# Altium schematic sheet Agilent_3Ghz_option.SchDoc
size A3
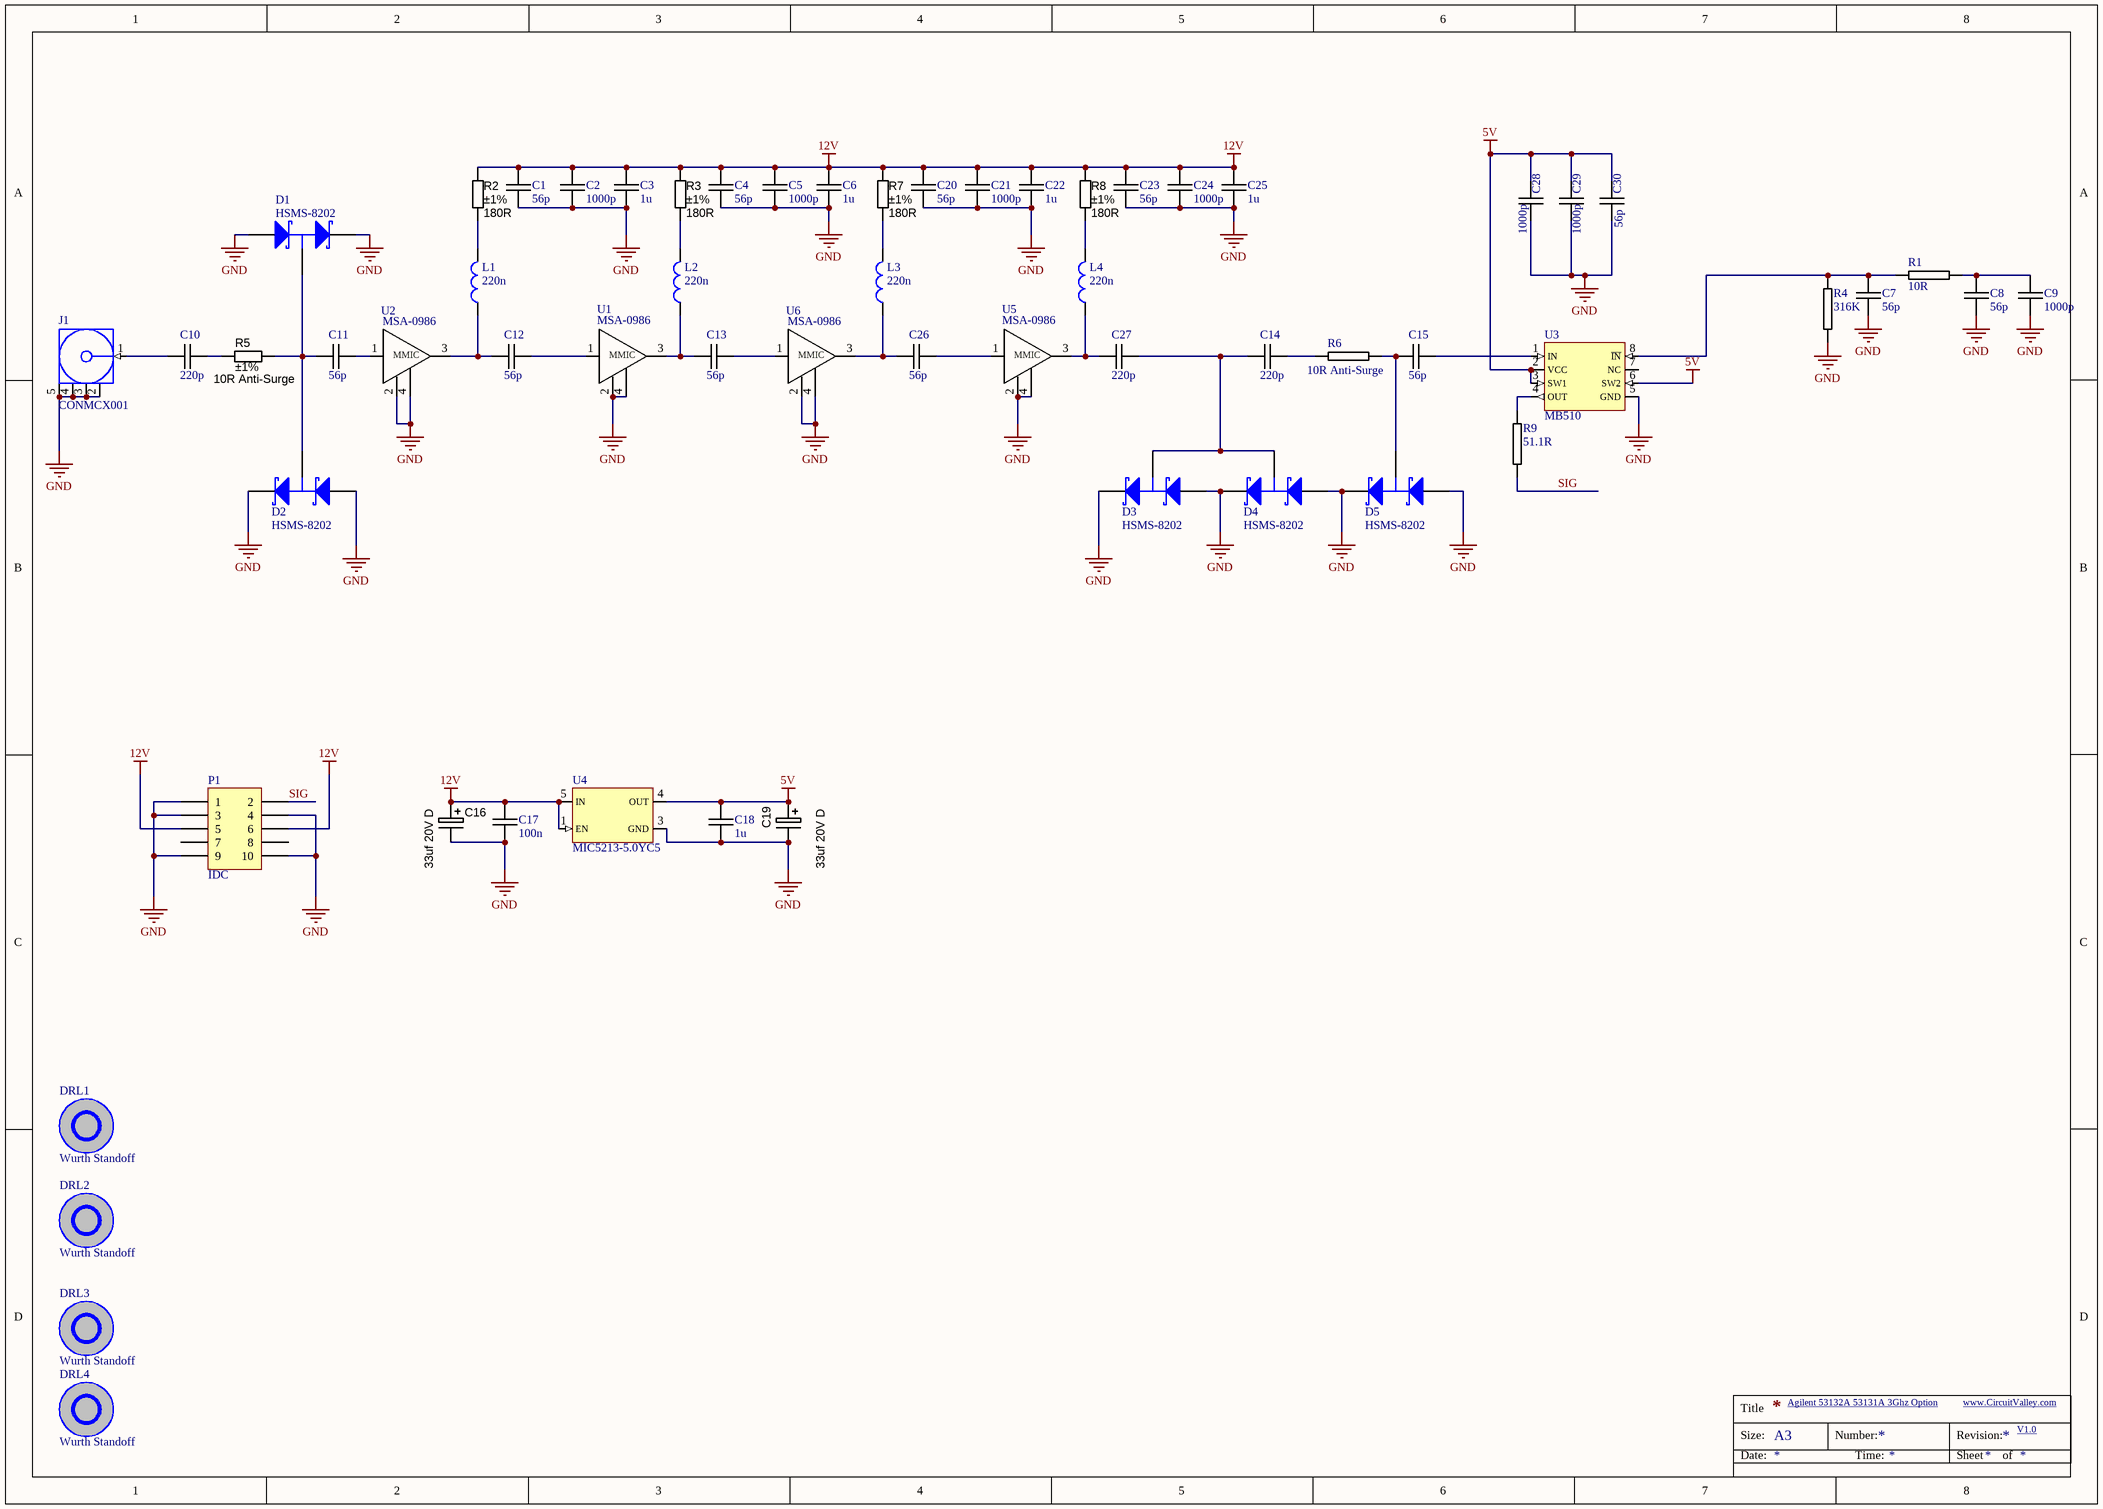
[diagram p0: Agilent_3Ghz_option.SchDoc]

## Parts
C1  56p  [0805C-TBD]
C2  1000p  [0805C-TBD]
C3  1u  [0805C-TBD]
C4  56p  [0805C-TBD]
C5  1000p  [0805C-TBD]
C6  1u  [0805C-TBD]
C7  56p  [0805C-TBD]
C8  56p  [0805C-TBD]
C9  1000p  [0805C-TBD]
C10  220p  [0805C-TBD]
C11  56p  [0805C-TBD]
C12  56p  [0805C-TBD]
C13  56p  [0805C-TBD]
C14  220p  [0805C-TBD]
C15  56p  [0805C-TBD]
C16  value 33uf 20V D  [CAPMP7343X310N]  (hidden comment: 47uf 20V D)
C17  100n  [0805C-TBD]
C18  1u  [0805C-TBD]
C19  value 33uf 20V D  [CAPMP7343X310N]  (hidden comment: 47uf 20V D)
C20  56p  [0805C-TBD]
C21  1000p  [0805C-TBD]
C22  1u  [0805C-TBD]
C23  56p  [0805C-TBD]
C24  1000p  [0805C-TBD]
C25  1u  [0805C-TBD]
C26  56p  [0805C-TBD]
C27  220p  [0805C-TBD]
C28  1000p  [0805C-TBD]
C29  1000p  [0805C-TBD]
C30  56p  [0805C-TBD]
D1  HSMS-8202  [SOT23_N]
D2  HSMS-8202  [SOT23_N]
D3  HSMS-8202  [SOT23_N]
D4  HSMS-8202  [SOT23_N]
D5  HSMS-8202  [SOT23_N]
DRL1  Wurth Standoff  [Wurth_PCB_STANDOFF_7740_6mm]
DRL2  Wurth Standoff  [Wurth_PCB_STANDOFF_7740_6mm]
DRL3  Wurth Standoff  [Wurth_PCB_STANDOFF_7740_6mm]
DRL4  Wurth Standoff  [Wurth_PCB_STANDOFF_7740_6mm]
J1  CONMCX001  [CON-MCX]
L1  220n  [NLV32T]
L2  220n  [NLV32T]
L3  220n  [NLV32T]
L4  220n  [NLV32T]
P1  IDC  [HDR2X5]
R1  10R  [0805R-TBD]
R2  value 180R  Tolerance: ±1%  [RESC5025N]  (hidden comment: Thick Film)
R3  value 180R  Tolerance: ±1%  [RESC5025N]  (hidden comment: Thick Film)
R4  316K  [0805R-TBD]
R5  value 10R Anti-Surge  Tolerance: ±1%  [RESC5025N]  (hidden comment: Thick Film)
R6  10R Anti-Surge  [0805R-TBD]
R7  value 180R  Tolerance: ±1%  [RESC5025N]  (hidden comment: Thick Film)
R8  value 180R  Tolerance: ±1%  [RESC5025N]  (hidden comment: Thick Film)
R9  51.1R  [0805R-TBD]
U1  MSA-0986  [SOT-86]
U2  MSA-0986  [SOT-86]
U3  MB510  [FPT-08P-M01]
U4  MIC5213-5.0YC5  [SC70-5]
U5  MSA-0986  [SOT-86]
U6  MSA-0986  [SOT-86]

## Nets
5V: C18.2 C19.1 C28.1 C29.1 C30.2 U3.2(VCC) U3.3(SW1) U3.6(SW2) U4.4(OUT)
12V: C1.2 C2.2 C3.2 C4.2 C5.2 C6.2 C16.1 C17.2 C20.2 C21.2 C22.2 C23.2 C24.2 C25.2 P1.5 P1.6 R2.1 R3.1 R7.1 R8.1 U4.1(EN) U4.5(IN)
GND: C1.1 C2.1 C3.1 C4.1 C5.1 C6.1 C7.1 C8.1 C9.1 C16.2 C17.1 C18.1 C19.2 C20.1 C21.1 C22.1 C23.1 C24.1 C25.1 C28.2 C29.2 C30.1 D1.1(A) D1.2(K) D2.1(A) D2.2(K) D3.1(A) D3.2(K) D4.1(A) D4.2(K) D5.1(A) D5.2(K) J1.2(GND) J1.3(GND) J1.4(GND) J1.5(GND) P1.1 P1.3 P1.4 P1.9 P1.10 R4.1 U1.2 U1.4 U2.2 U2.4 U3.5(GND) U4.3(GND) U5.2 U5.4 U6.2 U6.4
SIG: P1.2 R9.2
NetC7_2: C7.2 R1.1 R4.2 U3.8(~{IN})
NetC8_2: C8.2 C9.2 R1.2
NetC10_1: C10.1 J1.1(Signal)
NetC10_2: C10.2 R5.1
NetC11_1: C11.1 D1.3(C) D2.3(C) R5.2
NetC11_2: C11.2 U2.1(IN)
NetC12_1: C12.1 L1.1 U2.3
NetC12_2: C12.2 U1.1(IN)
NetC13_1: C13.1 L2.1 U1.3
NetC13_2: C13.2 U6.1(IN)
NetC14_1: C14.1 C27.2 D3.3(C) D4.3(C)
NetC14_2: C14.2 R6.1
NetC15_1: C15.1 D5.3(C) R6.2
NetC15_2: C15.2 U3.1(IN)
NetC26_1: C26.1 L3.1 U6.3
NetC26_2: C26.2 U5.1(IN)
NetC27_1: C27.1 L4.1 U5.3
NetL1_2: L1.2 R2.2
NetL2_2: L2.2 R3.2
NetL3_2: L3.2 R7.2
NetL4_2: L4.2 R8.2
NetR9_1: R9.1 U3.4(OUT)

Not connected (* = marked no-connect by the designer): P1 7 8; U3 7(NC)

## Notes on the sheet
- Agilent 53132A 53131A 3Ghz Option
- www.CircuitValley.com
- V1.0
- Title
- Size:
- Date:
- A3
- Number:
- Time:
- Revision:
- Sheet
- of
- (in symbol MMIC_SOT86_AG302-86G_SGA-5386Z) MMIC

## Library data of the parts
C1 C4 C7 C8 C11-C13 C15 C20 C23 C26 C30 = 0805C-TBD: CAPACITOR 0805 CERAMIC VALUE TO BE DETERMINED; Part: CC0805FRNPO9BN560
C2 C5 C9 C21 C24 C28 C29 = 0805C-TBD: CAPACITOR 0805 CERAMIC VALUE TO BE DETERMINED; Part: GRM2165C1H102FA01J
C3 C6 C18 C22 C25 = 0805C-TBD: CAPACITOR 0805 CERAMIC VALUE TO BE DETERMINED; Part: VJ0805V105ZXJCW1BC
C10 C14 C27 = 0805C-TBD: CAPACITOR 0805 CERAMIC VALUE TO BE DETERMINED; Part: CC0805FRNPO9BN221
C16 C19 = CAPT_330u_2917_6V3: Capacitor SMD Tant 330uF 20% 6V3 2917; Manufacturer Part Number: T520D337M006ATE015; Part: TAJD336K020R; Ratings: 6.3V; Material: Solid Tantalum; ESR (Equivalent Series Resistance): 15 mOhm; Package / Case: 2917 (7343 Metric); Tolerance: ±20%; Operating Temperature: -55°C ~ 125°C; Size / Dimension: 0.287" L x 0.169" W (7.30mm x 4.30mm); Height - Seated (Max): 0.122" (3.10mm); Manufacturer Size Code: D; Supplier 1: Digi-Key; Supplier Part Number 1: 399-4052-1-ND; ComponentLink1URL: http://www.kemet.com/datasheets&T520D337M006ATE015; ComponentLink1Description: T520D Datasheet
C17 = 0805C-TBD: CAPACITOR 0805 CERAMIC VALUE TO BE DETERMINED; Part: GRM21BR71H104KA01K
D1-D5 = BAT54S: Schottky Barrier Double Diode; Published: 17-Sep-2003; LatestRevisionDate: 12-Dec-2006; LatestRevisionNote: IPC-7351 Footprint Added.; DatasheetVersion: 4-Mar-2002; PackageVersion: May-1999; PackageReference: SOT23; Publisher: Altium Limited; PackageDescription: 3-Pin SOT-23 Package 0.95 mm Pitch, 2.3 mm Lead Span; ComponentLink1Description: Manufacturer Link; ComponentLink1URL: http://www.semiconductors.philips.com/; ComponentLink2Description: Datasheet; Part: HSMS-8202
DRL1-DRL4 = PCB_Sandoff: Part: 9774080360
J1 = CONMCX001: MCX Female PCB Mount Connector, Thru-Hole; Part: 919-382J-51P; PCB_Layout: Pads complies with manufacturer's recommendation.; DatasheetVersion: rev1.0, Jun-2006; PackageVersion: rev1.0, Jun-2006; PackageReference: CON-MCX; PackageDescription: MCX Female PCB Mount Connector, Thru-Hole, 6 x 6 mm Body; ComponentLink1Description: Manufacturer URL; ComponentLink1URL: http://www.linxtechnologies.com/; ComponentLink2Description: Datasheet; ComponentLink2URL: http://www.connectorcity.com/diagrams/MCX/CONMCX001.pdf
L1-L4 = inductor_smd: Partnumber: NLV32T-R22J-EF; Part: NLV32T-R22J-EF
P1 = Header 5X2: Header, 5-Pin, Dual row; Part: 69830010LF; LatestRevisionDate: 17-Jul-2002; LatestRevisionNote: Re-released for DXP Platform.; Publisher: Altium Limited
R1 R6 = 0805R-TBD: RESISTOR 0805 VALUE TO BE DETERMINED; Part: ESR10EZPJ100
R2 R3 R7 R8 = RES_1R_2010_1%: Resistor SMD chip 1 Ohm 1W 1% 2010; Manufacturer 1: Vishay/Dale; Manufacturer Part Number 1: CRCW20101R00FKEFHP; Part: RC2010FK-07180RL; Ratings: 1W; 400V; Package / Case: 2010 (5025 metric); Material: Thick Film; Supplier 1: Digi-Key; Supplier Part Number 1: 541-1.00PCT-ND
R4 = 0805R-TBD: RESISTOR 0805 VALUE TO BE DETERMINED; Part: RK73H2ATTD3163F
R5 = RES_1R_2010_1%: Resistor SMD chip 1 Ohm 1W 1% 2010; Manufacturer 1: Vishay/Dale; Manufacturer Part Number 1: CRCW20101R00FKEFHP; Part: CRS2010-FX-10R0ELF; Ratings: 1W; 400V; Package / Case: 2010 (5025 metric); Material: Thick Film; Supplier 1: Digi-Key; Supplier Part Number 1: 541-1.00PCT-ND
R9 = 0805R-TBD: RESISTOR 0805 VALUE TO BE DETERMINED; Part: RK73H2ATTE51R1F
U1 U2 U5 U6 = MMIC_SOT86_AG302-86G_SGA-5386Z: Part: MSA-0986
U4 = MIC5213: Part: MIC5213-5.0YC5
U3 = MB510: Part: MB510